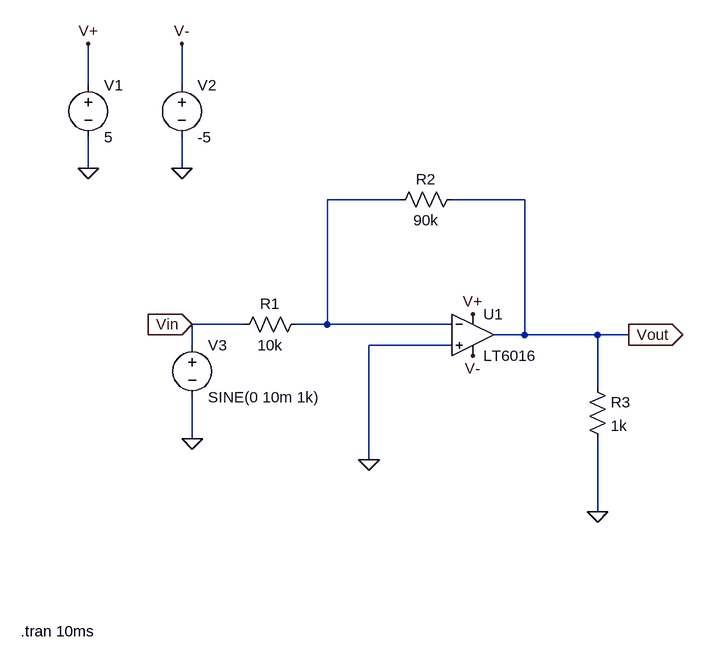
[diagram p0: schematic OPAmp-3.asc]
OPAmp-3.asc, the LTspice schematic file:
Version 4
SHEET 1 880 824
WIRE -192 -32 -192 -96
WIRE -48 -32 -48 -96
WIRE -192 96 -192 48
WIRE -48 96 -48 48
WIRE 288 144 176 144
WIRE 480 144 368 144
WIRE 48 336 -32 336
WIRE 176 336 176 144
WIRE 176 336 128 336
WIRE 368 336 176 336
WIRE 480 352 480 144
WIRE 480 352 432 352
WIRE 592 352 480 352
WIRE 640 352 592 352
WIRE -32 368 -32 336
WIRE 368 368 240 368
WIRE 592 432 592 352
WIRE -32 512 -32 448
WIRE 240 544 240 368
WIRE 592 624 592 512
FLAG -192 96 0
FLAG -48 96 0
FLAG 240 544 0
FLAG 640 352 Vout
IOPIN 640 352 Out
FLAG -48 -96 V-
FLAG -192 -96 V+
FLAG 400 320 V+
FLAG 400 384 V-
FLAG -32 336 Vin
IOPIN -32 336 In
FLAG -32 512 0
FLAG 592 624 0
SYMBOL voltage -192 -48 R0
SYMATTR InstName V1
SYMATTR Value 5
SYMBOL voltage -48 -48 R0
SYMATTR InstName V2
SYMATTR Value -5
SYMBOL Voltage -32 352 R0
SYMATTR InstName V3
SYMATTR Value SINE(0 10m 1k)
SYMBOL OpAmps/LT6016 400 352 R0
SYMATTR InstName U1
SYMBOL Res 144 320 R90
WINDOW 0 0 56 VBottom 2
WINDOW 3 32 56 VTop 2
SYMATTR InstName R1
SYMATTR Value 10k
SYMBOL Res 384 128 R90
WINDOW 0 0 56 VBottom 2
WINDOW 3 32 56 VTop 2
SYMATTR InstName R2
SYMATTR Value 90k
SYMBOL Res 576 416 R0
SYMATTR InstName R3
SYMATTR Value 1k
TEXT -296 808 Left 2 !.tran 10ms

The netlist it stands for:
* OPAmp-3.asc
V1 V+ 0 5
V2 V- 0 -5
V3 Vin 0 SINE(0 10m 1k)
* U1: LT6016 (symbol OpAmps/LT6016 not available, pins judged from their places): In+=0 In-=N001 V+=V+ V-=V- OUT=Vout
R1 N001 Vin 10k
R2 Vout N001 90k
R3 Vout 0 1k
.tran 10ms
.backanno
.end